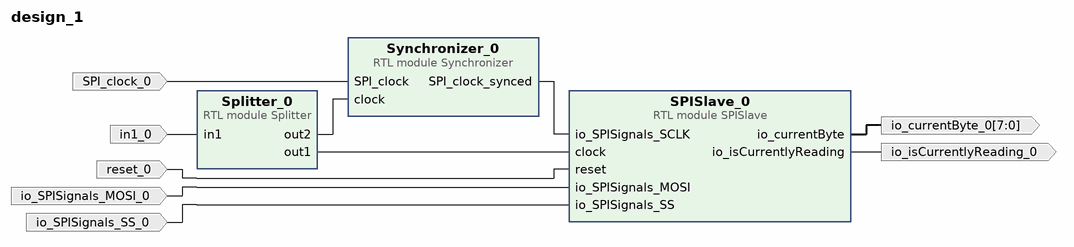
[diagram p0: block diagram of the top level]
# Vivado block design design_1, xc7a35ticsg324-1L, Vivado 2020.1
create_bd_design design_1

create_bd_port -dir I -type clk SPI_clock_0
create_bd_port -dir I -type rst reset_0
create_bd_port -dir I io_SPISignals_MOSI_0
create_bd_port -dir I io_SPISignals_SS_0
create_bd_port -dir O -from 7 -to 0 io_currentByte_0
create_bd_port -dir O io_isCurrentlyReading_0
create_bd_port -dir I in1_0

create_bd_cell -type module -reference Synchronizer Synchronizer_0
create_bd_cell -type module -reference Splitter Splitter_0
create_bd_cell -type module -reference SPISlave SPISlave_0

# ---- connections ----

connect_bd_net -net SPI_clock_0_1 [get_bd_ports SPI_clock_0] [get_bd_pins Synchronizer_0/SPI_clock]
connect_bd_net [get_bd_pins Synchronizer_0/SPI_clock_synced] [get_bd_pins SPISlave_0/io_SPISignals_SCLK]
connect_bd_net -net reset_0_1 [get_bd_ports reset_0] [get_bd_pins SPISlave_0/reset]
connect_bd_net -net io_SPISignals_MOSI_0_1 [get_bd_ports io_SPISignals_MOSI_0] [get_bd_pins SPISlave_0/io_SPISignals_MOSI]
connect_bd_net -net io_SPISignals_SS_0_1 [get_bd_ports io_SPISignals_SS_0] [get_bd_pins SPISlave_0/io_SPISignals_SS]
connect_bd_net [get_bd_pins SPISlave_0/io_currentByte] [get_bd_ports io_currentByte_0]
connect_bd_net [get_bd_pins SPISlave_0/io_isCurrentlyReading] [get_bd_ports io_isCurrentlyReading_0]
connect_bd_net [get_bd_pins Splitter_0/out2] [get_bd_pins Synchronizer_0/clock]
connect_bd_net [get_bd_pins Splitter_0/out1] [get_bd_pins SPISlave_0/clock]
connect_bd_net -net in1_0_1 [get_bd_ports in1_0] [get_bd_pins Splitter_0/in1]

validate_bd_design
save_bd_design
